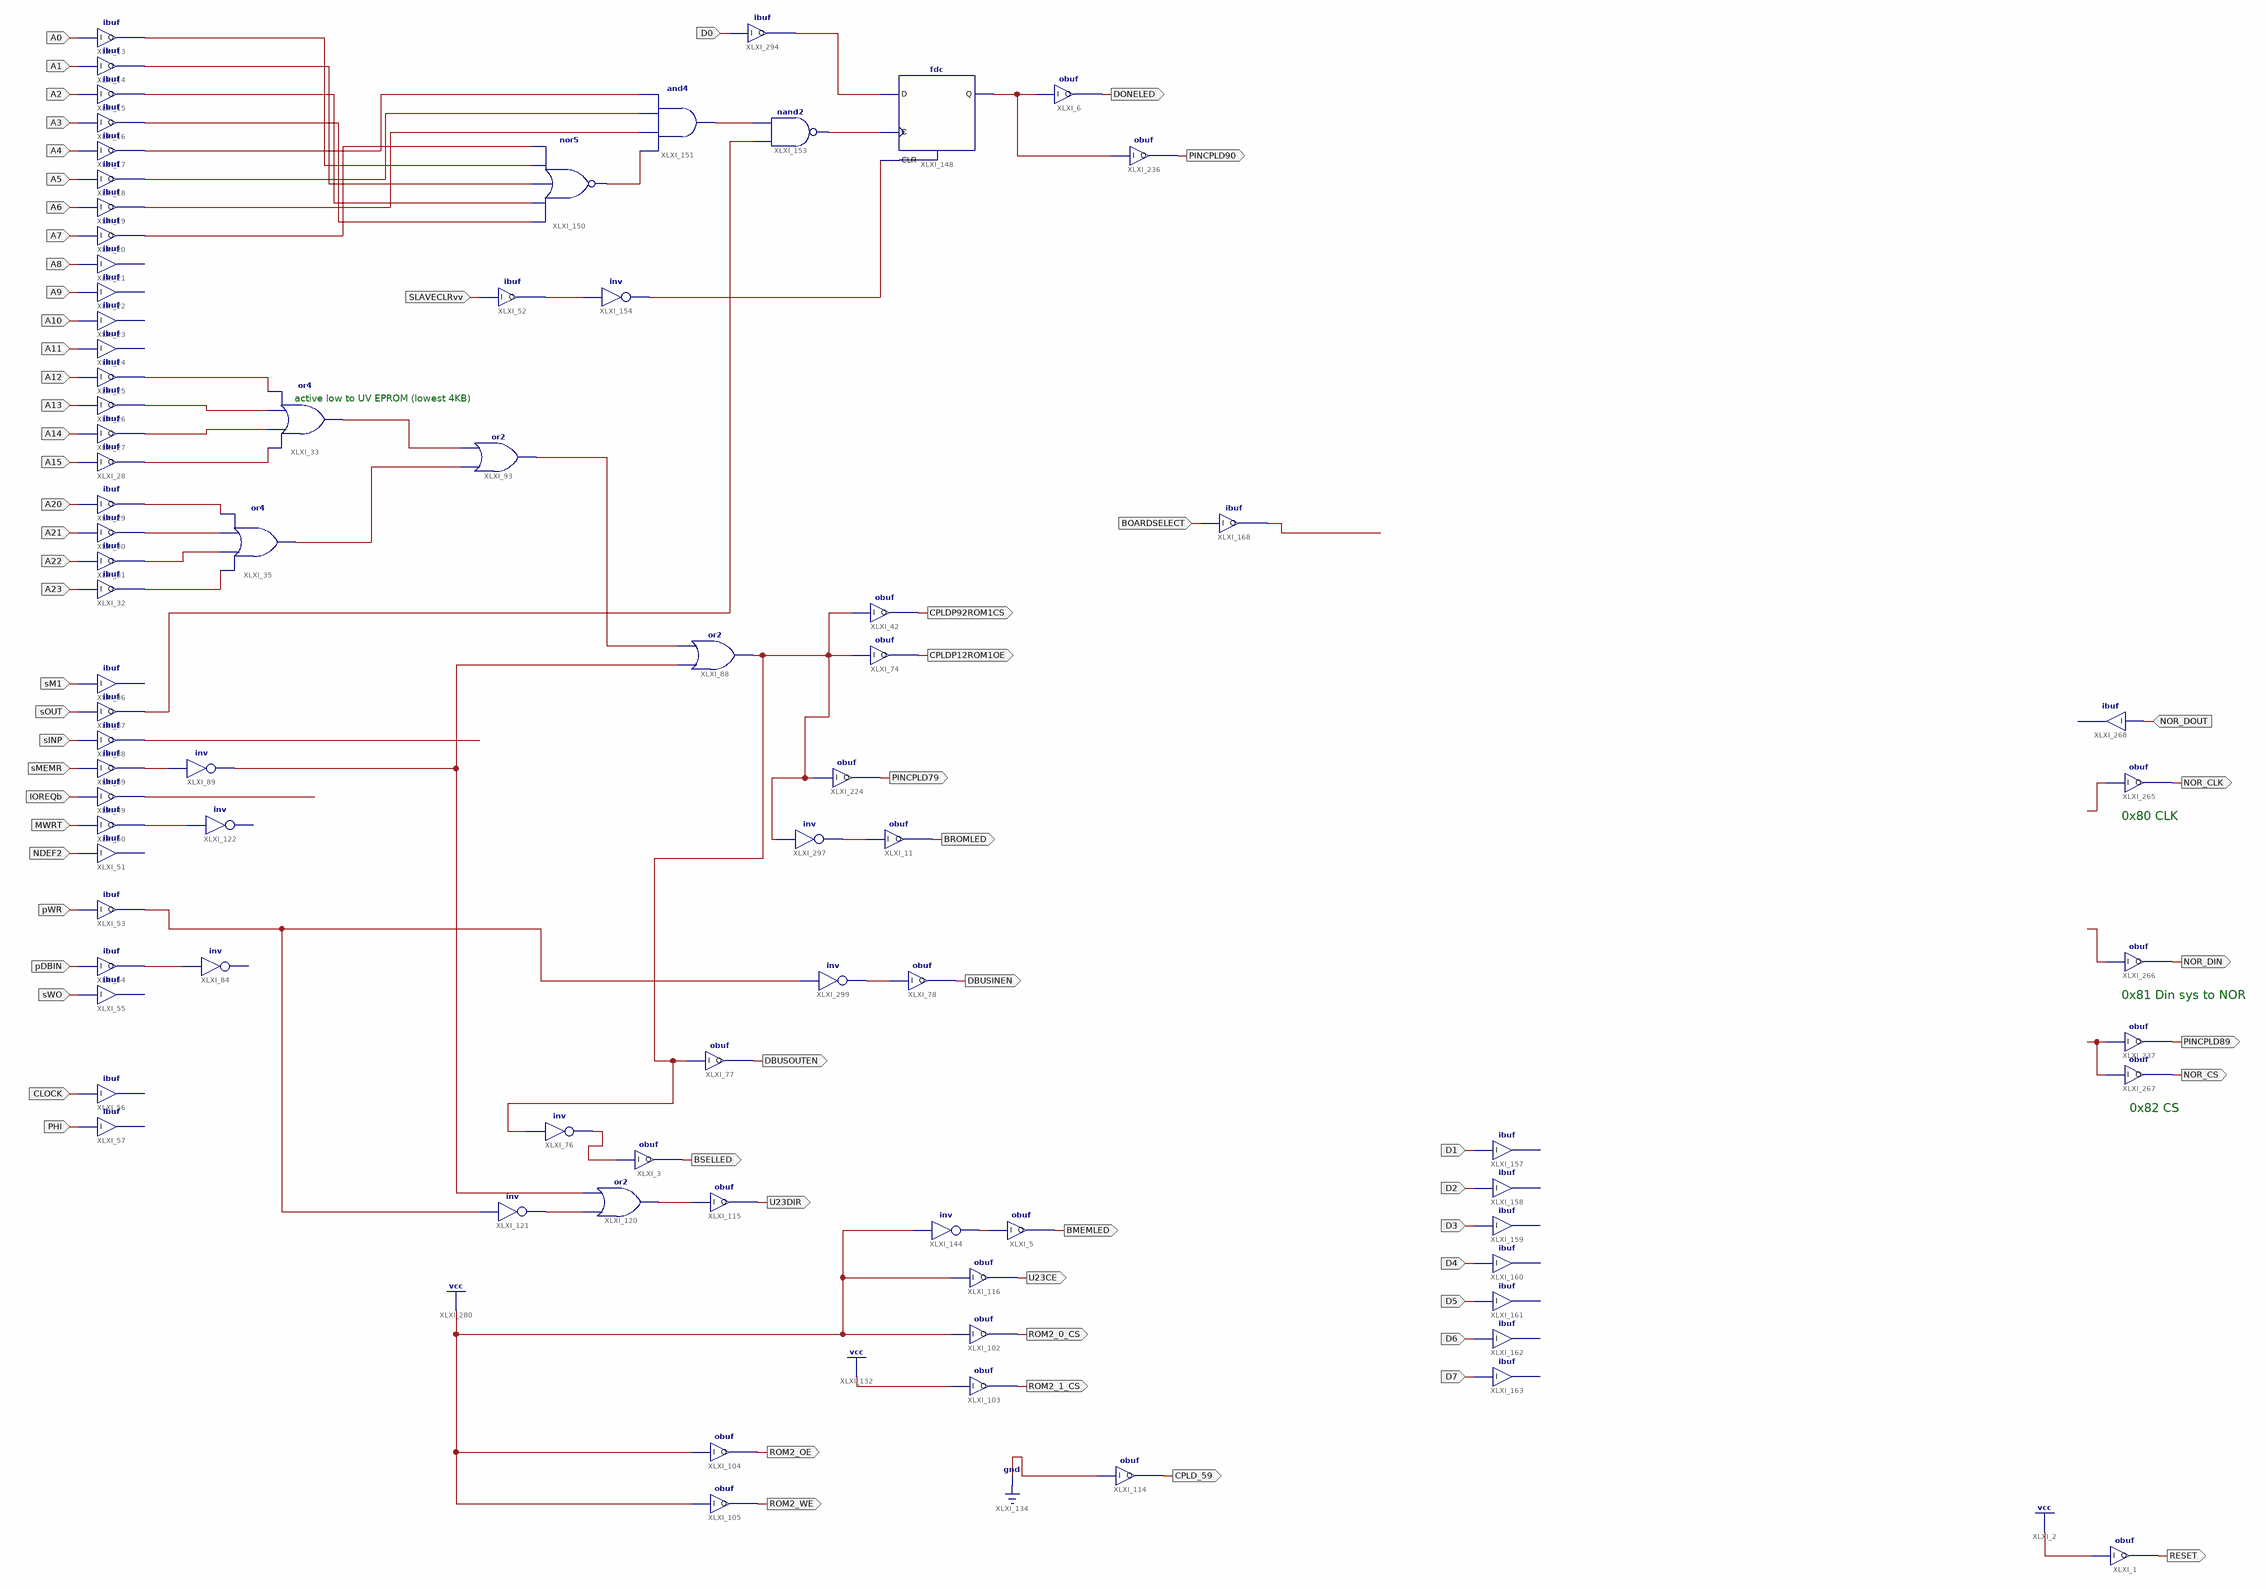
[diagram p0: schematic sheet 1]
// Xilinx ISE schematic U11v3.sch (xc9500xl) as structural Verilog: 83 symbols, 65 ports
module U11v3 (
  input  A0,
  input  A1,
  input  A2,
  input  A3,
  input  A4,
  input  A5,
  input  A6,
  input  A7,
  input  A8,
  input  A9,
  input  A10,
  input  A11,
  input  A12,
  input  A13,
  input  A14,
  input  A15,
  input  A20,
  input  A21,
  input  A22,
  input  A23,
  input  sM1,
  input  sOUT,
  input  sINP,
  input  sMEMR,
  input  IOREQb,
  input  MWRT,
  input  NDEF2,
  input  pWR,
  input  pDBIN,
  input  sWO,
  input  PHI,
  input  CLOCK,
  input  BOARDSELECT,
  input  D1,
  input  D2,
  input  D3,
  input  D4,
  input  D5,
  input  D6,
  input  D7,
  input  NOR_DOUT,
  input  D0,
  input  SLAVECLRvv,
  output CPLDP12ROM1OE,
  output ROM2_OE,
  output ROM2_WE,
  output U23DIR,
  output ROM2_0_CS,
  output ROM2_1_CS,
  output U23CE,
  output BMEMLED,
  output DONELED,
  output RESET,
  output PINCPLD89,
  output NOR_CLK,
  output NOR_DIN,
  output NOR_CS,
  output PINCPLD79,
  output PINCPLD90,
  output CPLD_59,
  output DBUSOUTEN,
  output BSELLED,
  output BROMLED,
  output CPLDP92ROM1CS,
  output DBUSINEN
);

  wire XLXN_35, XLXN_36, XLXN_37, XLXN_38, XLXN_40, XLXN_41, XLXN_42, XLXN_43, XLXN_103, XLXN_111, XLXN_112,
       XLXN_149, XLXN_151, XLXN_152, XLXN_153, XLXN_185, XLXN_188, XLXN_190, XLXN_191, XLXN_193, XLXN_194,
       XLXN_195, XLXN_197, XLXN_215, XLXN_217, XLXN_222, XLXN_223, XLXN_264, XLXN_265, XLXN_274, XLXN_287,
       XLXN_334, XLXN_335, XLXN_347, XLXN_373, XLXN_411, XLXN_416, XLXN_418, XLXN_440, XLXN_441, XLXN_442,
       XLXN_446, XLXN_450, XLXN_451, XLXN_454;

  ibuf XLXI_13 (.I(A0), .O(XLXN_264));
  ibuf XLXI_14 (.I(A1), .O(XLXN_191));
  ibuf XLXI_15 (.I(A2), .O(XLXN_190));
  ibuf XLXI_16 (.I(A3), .O(XLXN_215));
  ibuf XLXI_17 (.I(A4), .O(XLXN_188));
  ibuf XLXI_18 (.I(A5), .O(XLXN_217));
  ibuf XLXI_19 (.I(A6), .O(XLXN_265));
  ibuf XLXI_20 (.I(A7), .O(XLXN_193));
  ibuf XLXI_21 (.I(A8));  // open: O
  ibuf XLXI_22 (.I(A9));  // open: O
  ibuf XLXI_23 (.I(A10));  // open: O
  ibuf XLXI_24 (.I(A11));  // open: O
  ibuf XLXI_25 (.I(A12), .O(XLXN_38));
  ibuf XLXI_26 (.I(A13), .O(XLXN_37));
  ibuf XLXI_27 (.I(A14), .O(XLXN_36));
  ibuf XLXI_28 (.I(A15), .O(XLXN_35));
  ibuf XLXI_29 (.I(A20), .O(XLXN_40));
  ibuf XLXI_30 (.I(A21), .O(XLXN_41));
  ibuf XLXI_31 (.I(A22), .O(XLXN_42));
  ibuf XLXI_32 (.I(A23), .O(XLXN_43));
  or XLXI_33 (XLXN_441, XLXN_35, XLXN_36, XLXN_37, XLXN_38);
  or XLXI_35 (XLXN_440, XLXN_43, XLXN_42, XLXN_41, XLXN_40);
  ibuf XLXI_36 (.I(sM1));  // open: O
  ibuf XLXI_37 (.I(sOUT), .O(XLXN_195));
  ibuf XLXI_38 (.I(sINP), .O(XLXN_287));
  ibuf XLXI_39 (.I(sMEMR), .O(XLXN_111));
  ibuf XLXI_49 (.I(IOREQb), .O(XLXN_222));
  ibuf XLXI_50 (.I(MWRT), .O(XLXN_153));
  ibuf XLXI_51 (.I(NDEF2));  // open: O
  ibuf XLXI_53 (.I(pWR), .O(XLXN_149));
  ibuf XLXI_54 (.I(pDBIN), .O(XLXN_103));
  ibuf XLXI_55 (.I(sWO));  // open: O
  ibuf XLXI_57 (.I(PHI));  // open: O
  // inv XLXI_84 has open pins: I=XLXN_103, O=open
  obuf XLXI_74 (.I(XLXN_411), .O(CPLDP12ROM1OE));
  or XLXI_88 (XLXN_411, XLXN_112, XLXN_442);
  not XLXI_89 (XLXN_112, XLXN_111);
  ibuf XLXI_56 (.I(CLOCK));  // open: O
  or XLXI_93 (XLXN_442, XLXN_440, XLXN_441);
  obuf XLXI_42 (.I(XLXN_411), .O(CPLDP92ROM1CS));
  obuf XLXI_104 (.I(1'b1), .O(ROM2_OE));
  obuf XLXI_105 (.I(1'b1), .O(ROM2_WE));
  obuf XLXI_115 (.I(XLXN_152), .O(U23DIR));
  or XLXI_120 (XLXN_152, XLXN_151, XLXN_112);
  not XLXI_121 (XLXN_151, XLXN_149);
  // inv XLXI_122 has open pins: I=XLXN_153, O=open
  obuf XLXI_102 (.I(1'b1), .O(ROM2_0_CS));
  obuf XLXI_103 (.I(1'b1), .O(ROM2_1_CS));
  obuf XLXI_116 (.I(1'b1), .O(U23CE));
  obuf XLXI_5 (.I(XLXN_274), .O(BMEMLED));
  not XLXI_144 (XLXN_274, 1'b1);
  fdc XLXI_148 (.C(XLXN_451), .CLR(XLXN_450), .D(XLXN_446), .Q(XLXN_334));
  nor XLXI_150 (XLXN_185, XLXN_215, XLXN_190, XLXN_191, XLXN_264, XLXN_193);
  and XLXI_151 (XLXN_194, XLXN_185, XLXN_265, XLXN_217, XLXN_188);
  nand XLXI_153 (XLXN_451, XLXN_195, XLXN_194);
  obuf XLXI_6 (.I(XLXN_334), .O(DONELED));
  ibuf XLXI_157 (.I(D1));  // open: O
  ibuf XLXI_158 (.I(D2));  // open: O
  ibuf XLXI_159 (.I(D3));  // open: O
  ibuf XLXI_160 (.I(D4));  // open: O
  ibuf XLXI_161 (.I(D5));  // open: O
  ibuf XLXI_162 (.I(D6));  // open: O
  ibuf XLXI_163 (.I(D7));  // open: O
  obuf XLXI_1 (.I(1'b1), .O(RESET));
  obuf XLXI_237 (.I(XLXN_335), .O(PINCPLD89));
  obuf XLXI_265 (.I(XLXN_347), .O(NOR_CLK));
  obuf XLXI_266 (.I(XLXN_373), .O(NOR_DIN));
  obuf XLXI_267 (.I(XLXN_335), .O(NOR_CS));
  obuf XLXI_224 (.I(XLXN_411), .O(PINCPLD79));
  obuf XLXI_236 (.I(XLXN_334), .O(PINCPLD90));
  obuf XLXI_114 (.I(1'b0), .O(CPLD_59));
  obuf XLXI_77 (.I(XLXN_411), .O(DBUSOUTEN));
  not XLXI_76 (XLXN_416, XLXN_411);
  obuf XLXI_3 (.I(XLXN_416), .O(BSELLED));
  obuf XLXI_11 (.I(XLXN_418), .O(BROMLED));
  not XLXI_297 (XLXN_418, XLXN_411);
  ibuf XLXI_268 (.I(NOR_DOUT));  // open: O
  ibuf XLXI_168 (.I(BOARDSELECT), .O(XLXN_223));
  ibuf XLXI_294 (.I(D0), .O(XLXN_446));
  ibuf XLXI_52 (.I(SLAVECLRvv), .O(XLXN_197));
  not XLXI_154 (XLXN_450, XLXN_197);
  not XLXI_299 (XLXN_454, XLXN_149);
  obuf XLXI_78 (.I(XLXN_454), .O(DBUSINEN));

  // Notes on the sheet:
  //   active low to UV EPROM (lowest 4KB)
  //   0x80 CLK
  //   0x81 Din sys to NOR
  //   0x82 CS
endmodule
